# Altium schematic sheet STRWL-S03-V00-CAN_MAIN.SchDoc
size A3; SheetNumber: 3; SheetTotal: 6
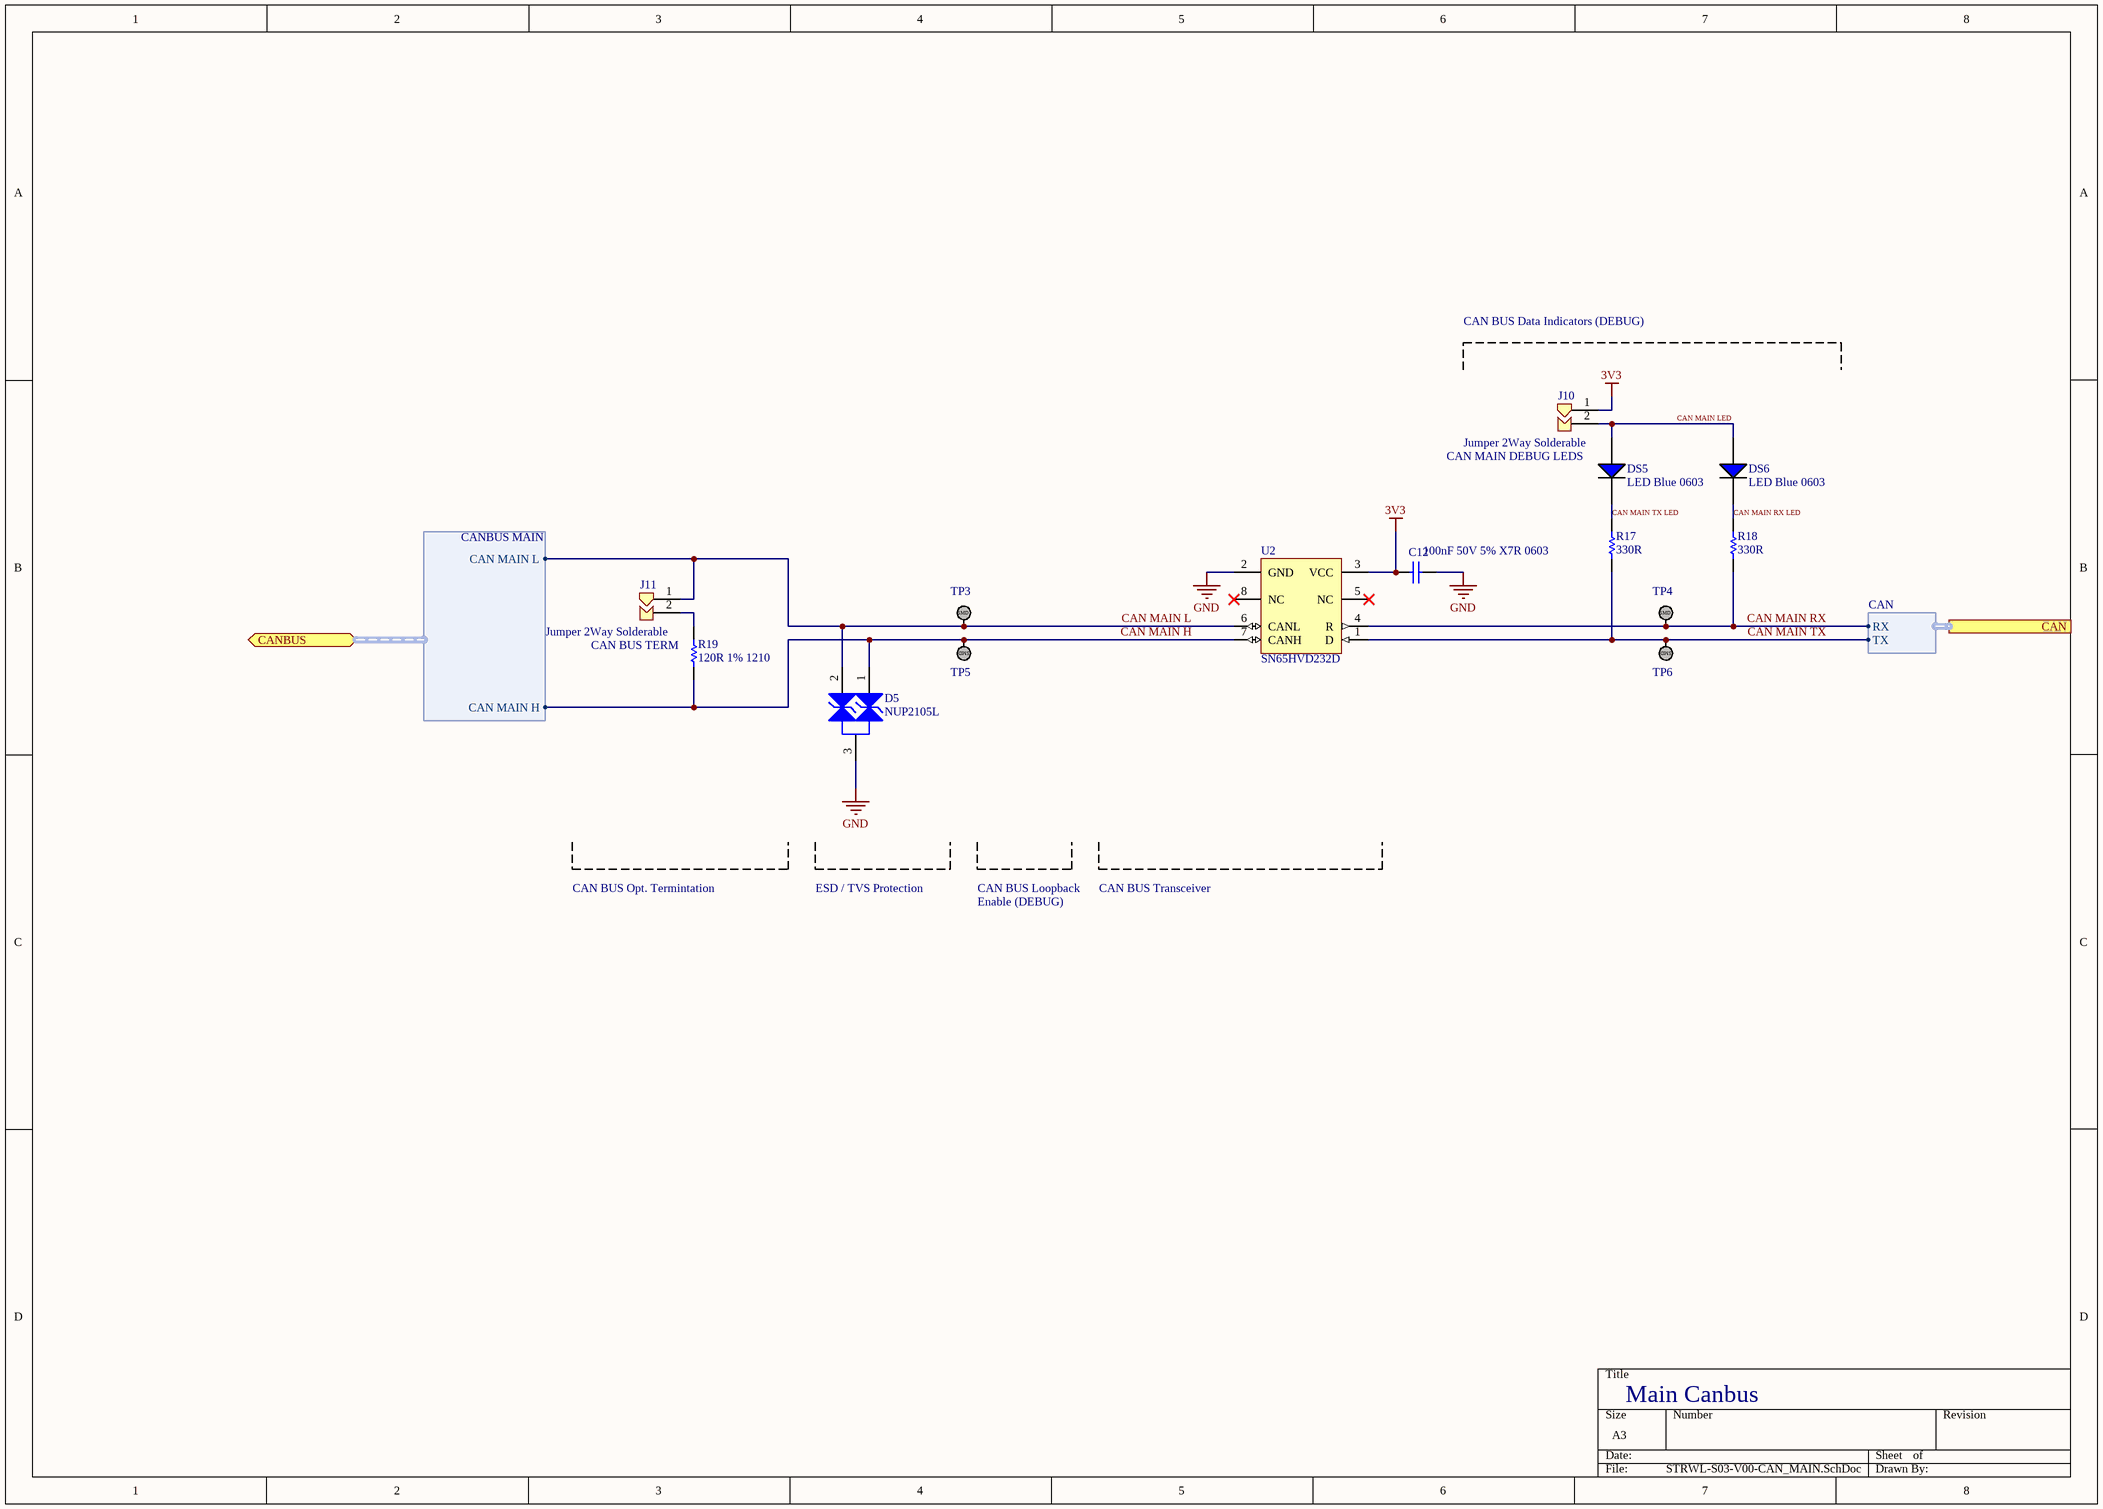
[diagram p0: STRWL-S03-V00-CAN_MAIN.SchDoc]

## Parts
C12  100nF 50V 5% X7R 0603  [Cap_Ceramic_0603]
D5  NUP2105L  [NUP2105L]
DS5  LED Blue 0603  [LED BLUE 0603]
DS6  LED Blue 0603  [LED BLUE 0603]
J10  Jumper 2Way Solderable  [Jumper_2Way_Solderable]
J11  Jumper 2Way Solderable  [Jumper_2Way_Solderable]
R17  330R  [Res_ThinFilm_0603]
R18  330R  [Res_ThinFilm_0603]
R19  120R 1% 1210  [Res_ThinFilm_1210]
TP3  TestPoint_SMD  [TestPointSMD]  (value not drawn)
TP4  TestPoint_SMD  [TestPointSMD]  (value not drawn)
TP5  TestPoint_SMD  [TestPointSMD]  (value not drawn)
TP6  TestPoint_SMD  [TestPointSMD]  (value not drawn)
U2  SN65HVD232D  [D0008A_L]

## Ports
CAN (harness CAN), CANBUS (bidir, harness CANBUS MAIN)

## Harnesses
CANBUS MAIN: CAN MAIN L, CAN MAIN H
CAN: TX, RX

## Nets
3V3: C12.1 J10.1 U2.3(VCC)
GND: C12.2 D5.3 U2.2(GND)
CAN MAIN H: D5.1 R19.1 TP5.1 U2.7(CANH) ; port CANBUS.CAN MAIN H
CAN MAIN L: D5.2 J11.1 TP3.1 U2.6(CANL) ; port CANBUS.CAN MAIN L
CAN MAIN LED: DS5.1(A) DS6.1(A) J10.2
CAN MAIN RX: R18.1 TP4.1 U2.4(R) ; port CAN.RX
CAN MAIN RX LED: DS6.2(C) R18.2
CAN MAIN TX: R17.1 TP6.1 U2.1(D) ; port CAN.TX
CAN MAIN TX LED: DS5.2(C) R17.2
NetJ11_2: J11.2 R19.2

Not connected (* = marked no-connect by the designer): U2 5(NC)* 8(NC)*

## Notes on the sheet
- CAN BUS Data Indicators (DEBUG)
- CAN MAIN DEBUG LEDS
- (near R19) CAN BUS TERM
- CAN BUS Opt. Termintation
- ESD / TVS Protection
- CAN BUS Loopback
- Enable (DEBUG)
- CAN BUS Transceiver
- Main Canbus
- (in symbol TestPoint_SMD) SMD

## Library data of the parts
C12 = 100nF 50V 5% X7R 0603: Capacitor, Ceramic, SMD, 100nF, 50V, 5%, X7R, 0603
J10 J11 = Jumper 2Way Side Solderable
R17 R18 = 330R 5% 0603: Resistor, SMD, 330R, 0.1W, 5%, 0603
R19 = 120R 1% 1210: Resistor, SMD, 120R, 0.25W, 1%, 1210
U2 = CMP-0315-00073-2: 3.3 V CAN Transceiver, 17 mA, -40 to 85 degC, 8-pin SOIC (D), Green (RoHS & no Sb/Br); Manufacturer: Texas Instruments; Supply Voltage(s)(V): 3.3; Transient Pulse Protection(V): -25 to 25; ICC(Max)(mA): 17; Drivers Per Package: 1; Rating: Catalog; Code_JEDEC: MS-012AA; Mounting Technology: Surface Mount; PackageDescription: 8-Pin Plastic Small Outline Integrated Circuit, 4.9 x 3.9 mm, Pitch 1.27 mm Pitch; SubFamily: CAN; PackageVersion: revM, Jun-2011; Isolated: No; DatasheetVersion: SLOS346K; PackageReference: D0008A; Receivers Per Package: 1; Footprint: SN65HVD232; ComponentLink1Description: Datasheet; PartNumber: SN65HVD232D; Eco-Plan: Green (RoHS & no Sb/Br); ComponentLink1URL: http://www.ti.com/general/docs/lit/getliterature.tsp?genericPartNumber=SN65HVD232&fileType=pdf
D5 = NUP2105L: ComponentLink1Description: Datasheet; ComponentLink1URL: https://www.onsemi.cn/PowerSolutions/document/NUP2105L-D.PDF; Parameter 1: *; ComponentLink2Description: LCSC; ComponentLink2URL: https://lcsc.com/product-detail/TVS_ON-Semiconductor-NUP2105LT1G_C14486.html; ComponentLink3Description: Digikey; ComponentLink3URL: https://www.digikey.com.au/product-detail/en/on-semiconductor/SZNUP2105LT1G/SZNUP2105LT1GOSCT-ND/3487669